# Altium schematic sheet Schematic_V6.SchDoc
size A4
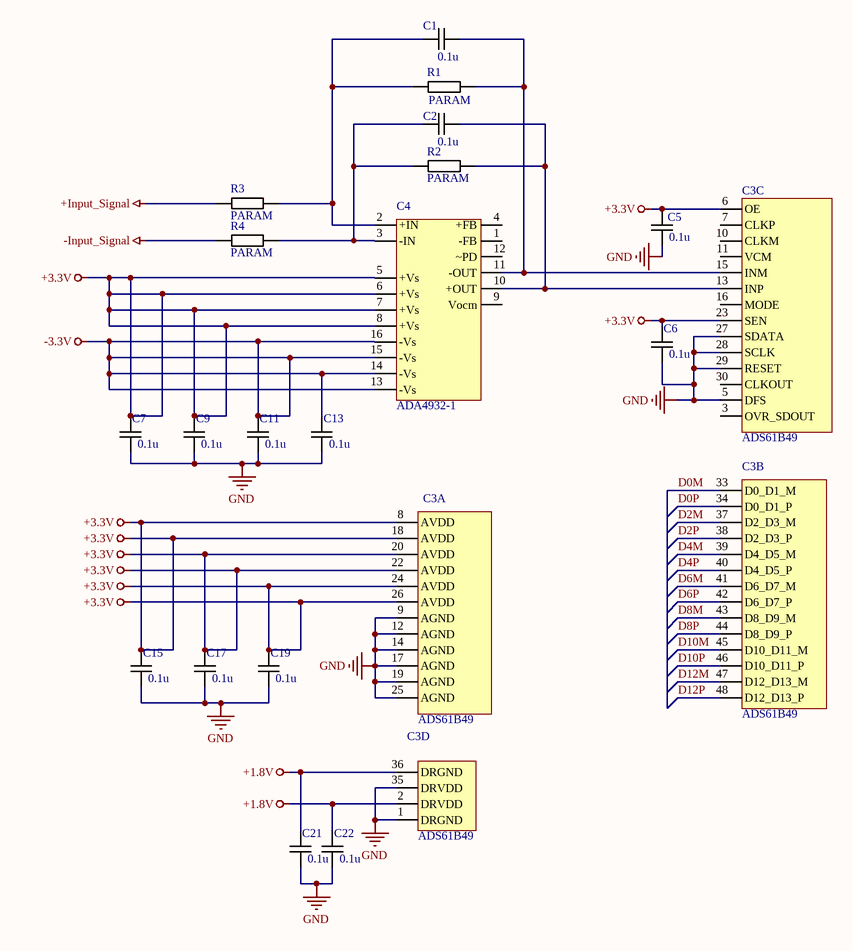
[diagram p0: Schematic_V6.SchDoc]

## Parts
C1  0.1u  [Capacitor]
C2  0.1u  [Capacitor]
C3  ADS61B49  [VQFN49]  (parts A,B,C,D of 4)
C4  ADA4932-1  [CP-16-2]
C5  0.1u  [Capacitor]
C6  0.1u  [Capacitor]
C7  0.1u  [Capacitor]
C9  0.1u  [Capacitor]
C11  0.1u  [Capacitor]
C13  0.1u  [Capacitor]
C15  0.1u  [Capacitor]
C17  0.1u  [Capacitor]
C19  0.1u  [Capacitor]
C21  0.1u  [Capacitor]
C22  0.1u  [Capacitor]
R1  PARAM  [Resistor]
R2  PARAM  [Resistor]
R3  PARAM  [Resistor]
R4  PARAM  [Resistor]

## Nets
+1.8V: C3.2(DRVDD) C3.36(DRGND) C21.2 C22.2
+3.3V: C3.6(OE) C3.8(AVDD) C3.18(AVDD) C3.20(AVDD) C3.22(AVDD) C3.23(SEN) C3.24(AVDD) C3.26(AVDD) C4.5(+Vs) C4.6(+Vs) C4.7(+Vs) C4.8(+Vs) C5.2 C6.2 C7.2 C9.2 C15.2 C17.2 C19.2
+Input_Signal: R3.1
-3.3V: C4.13(-Vs) C4.14(-Vs) C4.15(-Vs) C4.16(-Vs) C11.2 C13.2
-Input_Signal: R4.1
GND: C3.1(DRGND) C3.5(DFS) C3.9(AGND) C3.12(AGND) C3.14(AGND) C3.17(AGND) C3.19(AGND) C3.25(AGND) C3.27(SDATA) C3.28(SCLK) C3.29(RESET) C3.35(DRVDD) C5.1 C6.1 C7.1 C9.1 C11.1 C13.1 C15.1 C17.1 C19.1 C21.1 C22.1
D0M: C3.33(D0_D1_M)
D0P: C3.34(D0_D1_P)
D2M: C3.37(D2_D3_M)
D2P: C3.38(D2_D3_P)
D4M: C3.39(D4_D5_M)
D4P: C3.40(D4_D5_P)
D6M: C3.41(D6_D7_M)
D6P: C3.42(D6_D7_P)
D8M: C3.43(D8_D9_M)
D8P: C3.44(D8_D9_P)
D10M: C3.45(D10_D11_M)
D10P: C3.46(D10_D11_P)
D12M: C3.47(D12_D13_M)
D12P: C3.48(D12_D13_P)
NetC1_1: C1.1 C3.15(INM) C4.11(-OUT) R1.2
NetC1_2: C1.2 C4.2(+IN) R1.1 R3.2
NetC2_1: C2.1 C4.3(-IN) R2.1 R4.2
NetC2_2: C2.2 C3.13(INP) C4.10(+OUT) R2.2

Not connected (* = marked no-connect by the designer): C3 3(OVR_SDOUT) 7(CLKP) 10(CLKM) 11(VCM) 16(MODE) 30(CLKOUT); C4 1(-FB) 4(+FB) 9(Vocm) 12(~PD)

## Library data of the parts
C1 C2 C5-C7 C9 C11 C13 C15 C17 C19 C21 C22 = Capacitor
R1-R4 = Resistor